# EasyEDA Pro project ProPrj_mykeyboard_2026-01-25.epro, board mykeyboard
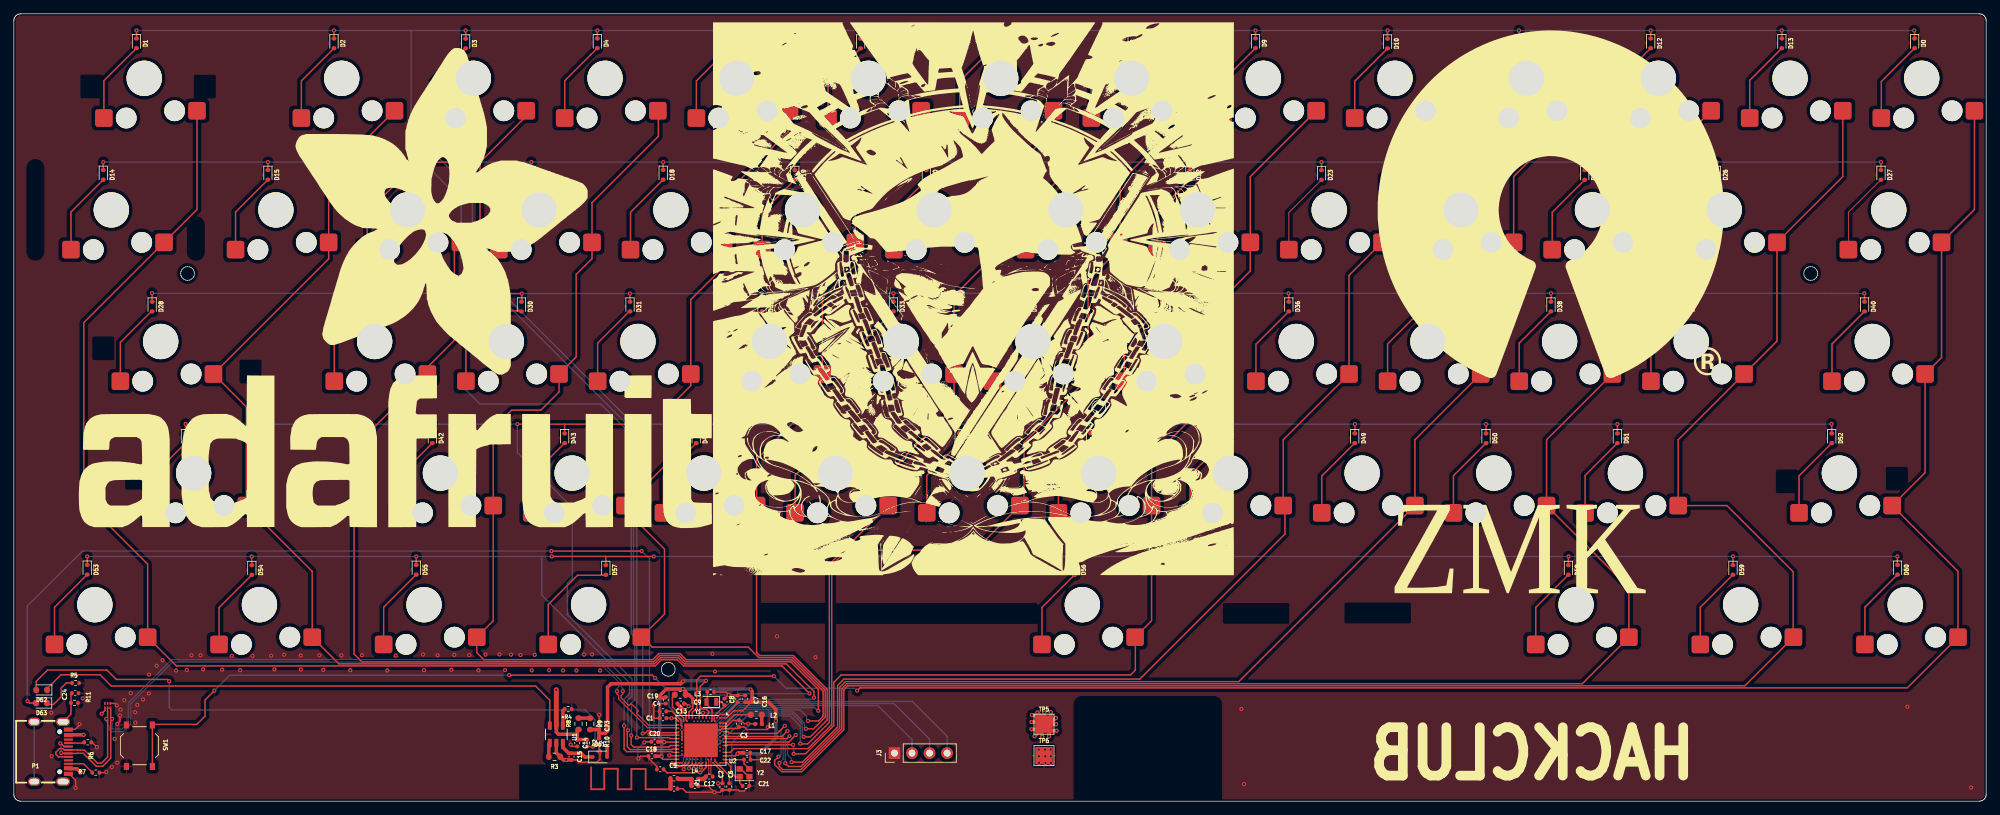
[diagram p1: board, top side]
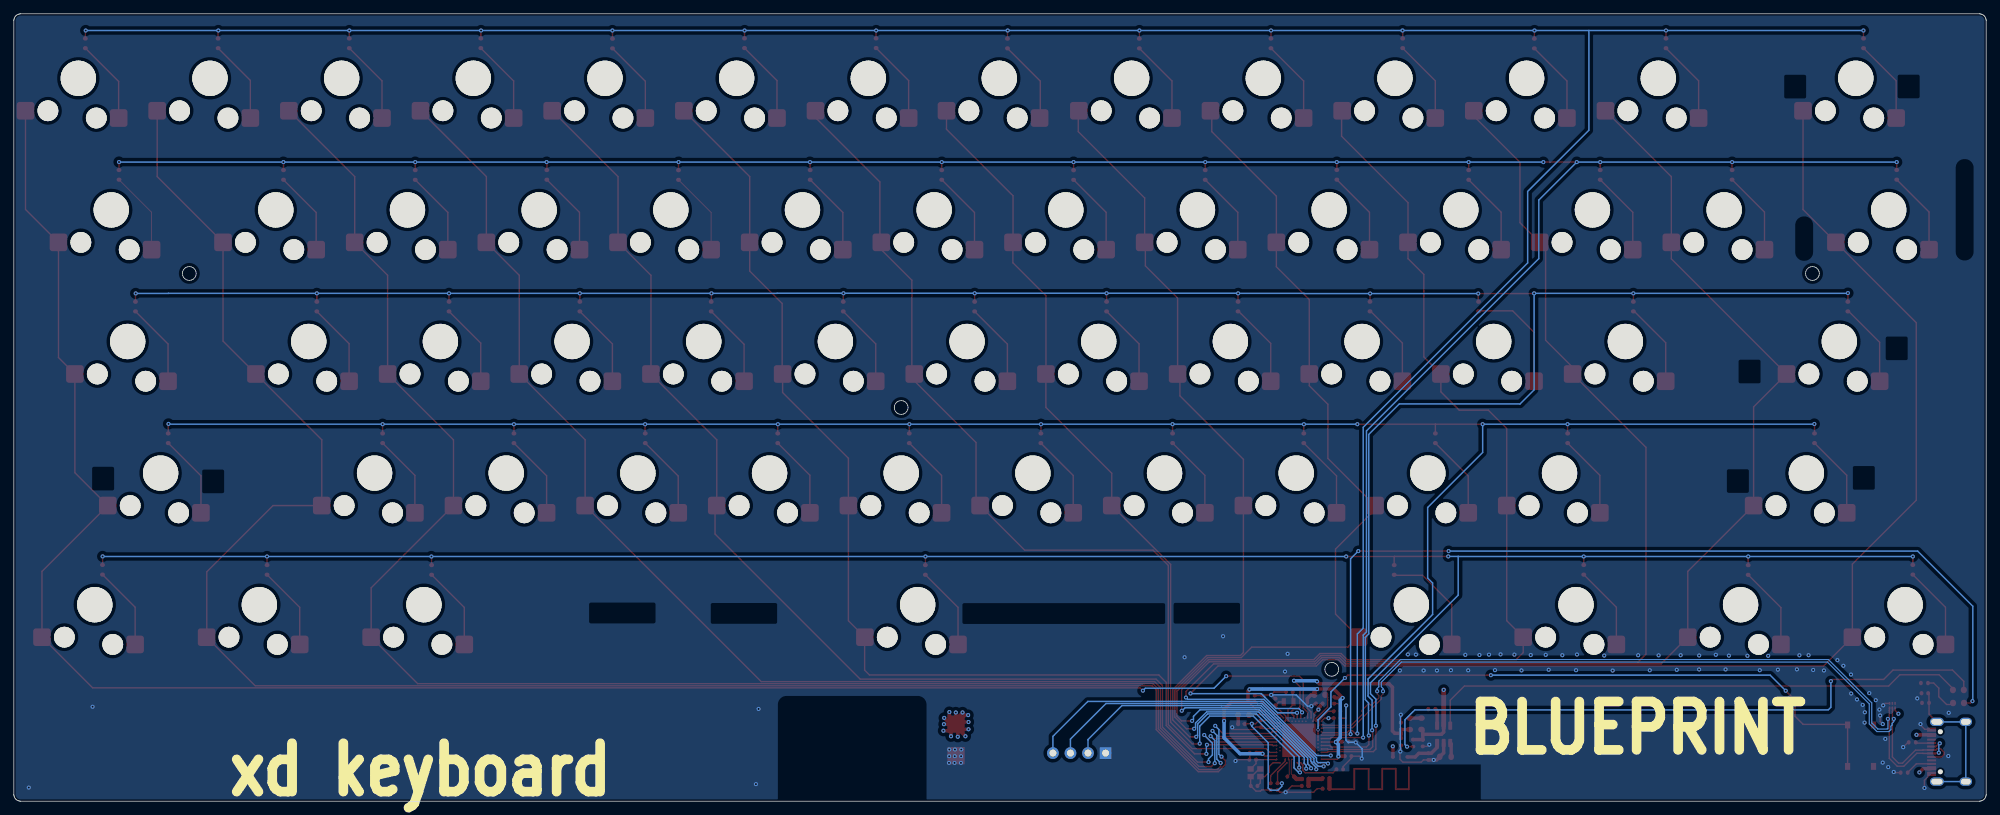
[diagram p2: board, bottom side, seen from below]

Outline 285.38 x 113.98 mm; copper layers: Top Layer, Inner1, Inner2, Bottom Layer. Coordinates in mm from the lower left corner of the outline.
Outline path: 0,112.98 0,1 0,0.92 0.01,0.84 0.03,0.77 0.05,0.69 0.08,0.62 0.11,0.55 0.15,0.48 0.19,0.41 0.24,0.35 0.29,0.29 0.35,0.24 0.41,0.19 0.48,0.15 0.55,0.11 0.62,0.08 0.69,0.05 0.77,0.03 0.84,0.01 0.92,0 1,0 284.37,0 284.45,0 284.53,0.01 284.61,0.03 284.68,0.05 284.76,0.08 284.83,0.11 284.9,0.15 284.96,0.19 285.03,0.24 285.08,0.29 285.14,0.35 285.19,0.41 285.23,0.48 285.27,0.55 285.3,0.62 285.33,0.69 285.35,0.77 285.36,0.84 285.37,0.92 285.38,1 285.38,112.98 285.37,113.05 285.36,113.13 285.35,113.21 285.33,113.28 285.3,113.36 285.27,113.43 285.23,113.5 285.19,113.56 285.14,113.63 285.08,113.68 285.03,113.74 284.96,113.79 284.9,113.83 284.83,113.87 284.76,113.9 284.68,113.93 284.61,113.95 284.53,113.96 284.45,113.97 284.37,113.98 1,113.98 0.92,113.97 0.84,113.96 0.77,113.95 0.69,113.93 0.62,113.9 0.55,113.87 0.48,113.83 0.41,113.79 0.35,113.74 0.29,113.68 0.24,113.63 0.19,113.56 0.15,113.5 0.11,113.43 0.08,113.36 0.05,113.28 0.03,113.21 0.01,113.13 0,113.05 0,112.98 ; 24.14,76.39 24.19,76.7 24.33,76.98 24.55,77.2 24.83,77.34 25.14,77.39 25.45,77.34 25.73,77.2 25.95,76.98 26.09,76.7 26.14,76.39 26.09,76.08 25.95,75.8 25.73,75.58 25.45,75.44 25.14,75.39 24.83,75.44 24.55,75.58 24.33,75.8 24.19,76.08 24.14,76.39 ; 93.69,19.09 93.73,19.4 93.88,19.68 94.1,19.9 94.38,20.04 94.69,20.09 95,20.04 95.28,19.9 95.5,19.68 95.64,19.4 95.69,19.09 95.64,18.78 95.5,18.5 95.28,18.28 95,18.14 94.69,18.09 94.38,18.14 94.1,18.28 93.88,18.5 93.73,18.78 93.69,19.09 ; 155.99,56.99 156.03,57.3 156.18,57.58 156.4,57.8 156.68,57.94 156.99,57.99 157.3,57.94 157.57,57.8 157.8,57.58 157.94,57.3 157.99,56.99 157.94,56.68 157.8,56.4 157.57,56.18 157.3,56.04 156.99,55.99 156.68,56.04 156.4,56.18 156.18,56.4 156.03,56.68 155.99,56.99 ; 258.99,76.39 259.04,76.7 259.18,76.98 259.4,77.2 259.68,77.34 259.99,77.39 260.3,77.34 260.57,77.2 260.8,76.98 260.94,76.7 260.99,76.39 260.94,76.08 260.8,75.8 260.57,75.58 260.3,75.44 259.99,75.39 259.68,75.44 259.4,75.58 259.18,75.8 259.04,76.08 258.99,76.39
Stack: Top Layer 0.035mm Outer layer thickness 1oz / Dielectric1 0.2104mm 7628 RC49% 8.6mil / Inner1 0.0152mm Inner layer thickness / Dielectric2 1.065mm 1.1mm H/HOZ Copper / Inner2 0.0152mm Inner layer thickness / Dielectric3 0.2104mm 7628 RC49% 8.6mil / Bottom Layer 0.035mm Outer layer thickness 1oz

## Design rules (mm)
net USB_D-: DP1
net USB_D+: DP1
template: User Custom Config
spacing safeClearance (default): track to track 0.1, other pairs 0.1 to 0.3
track width trackWidth (default): min 0.127, default 0.254, max 2.54
differential pair differentialPair (default): width min 0.127, default 0.158, max 2.54; gap min 0.203, default 0.203
via viaSize (default): diameter min 0.3, default 0.6, max 10; hole min 0.2, default 0.3, max 6
net GND uses CopperRegion2
pour ie3188 uses CopperRegion2

## Placement (name value [footprint] x y rotation side)
C1  4.7uF  [Capacitor_SMD:C_0402_1005Metric]  93.92 12.01 0 top
C2  1uF  [Capacitor_SMD:C_0402_1005Metric]  102.52 2.11 90 top
C3  47nF  [Capacitor_SMD:C_0402_1005Metric]  104.92 11.21 90 top
C4  4.7uF  [Capacitor_SMD:C_0402_1005Metric]  93.92 13.01 180 top
C5  1nF  [Capacitor_SMD:C_0402_1005Metric]  93.52 4.61 180 top
C6  100pF  [Capacitor_SMD:C_0402_1005Metric]  103.52 2.11 270 top
C7  100nF  [Capacitor_SMD:C_0402_1005Metric]  104.72 14.81 90 top
C8  15pF  [Capacitor_SMD:C_0402_1005Metric]  102.82 14.36 270 top
C9  15pF  [Capacitor_SMD:C_0402_1005Metric]  100.82 15.81 180 top
C10  1.5pF  [Capacitor_SMD:C_0402_1005Metric]  95.52 1.81 180 top
C11  1pF  [Capacitor_SMD:C_0402_1005Metric]  98.52 2.21 180 top
C12  1pF  [Capacitor_SMD:C_0402_1005Metric]  100.62 3.56 180 top
C13  4.7uF  [Capacitor_SMD:C_0402_1005Metric]  96.49 14.13 180 top
C14  1uF  [Capacitor_SMD:C_0402_1005Metric]  81.52 8.41 270 top
C15  1uF  [Capacitor_SMD:C_0402_1005Metric]  80.69 6.45 270 top
C16  100nF  [Capacitor_SMD:C_0402_1005Metric]  105.82 14.81 270 top
C17  100nF  [Capacitor_SMD:C_0402_1005Metric]  106.07 7.01 180 top
C18  100nF  [Capacitor_SMD:C_0402_1005Metric]  92.32 6.51 0 top
C19  4.7uF  [Capacitor_SMD:C_0402_1005Metric]  94.32 14.61 90 top
C20  1uF  [Capacitor_SMD:C_0402_1005Metric]  92.72 8.61 0 top
C21  15pF  [Capacitor_SMD:C_0402_1005Metric]  105.92 2.21 0 top
C22  15pF  [Capacitor_SMD:C_0402_1005Metric]  106.12 6.01 0 top
C23  10nF  [Capacitor_SMD:C_0402_1005Metric]  84.68 10.88 270 top
C24  1000pF/NC  [Capacitor_SMD:C_0402_1005Metric]  8.87 15.63 0 top
D0  D  [Diode_SMD:D_SOD-523]  275.02 109.7 270 top
D1  D  [Diode_SMD:D_SOD-523]  17.74 109.7 270 top
D2  D  [Diode_SMD:D_SOD-523]  46.33 109.7 270 top
D3  D  [Diode_SMD:D_SOD-523]  65.38 109.67 270 top
D4  D  [Diode_SMD:D_SOD-523]  84.42 109.7 270 top
D5  D  [Diode_SMD:D_SOD-523]  103.48 109.69 270 top
D6  D  [Diode_SMD:D_SOD-523]  122.53 109.68 270 top
D7  D  [Diode_SMD:D_SOD-523]  141.6 109.68 270 top
D8  D  [Diode_SMD:D_SOD-523]  160.61 109.72 270 top
D9  D  [Diode_SMD:D_SOD-523]  179.66 109.72 270 top
D10  D  [Diode_SMD:D_SOD-523]  198.75 109.67 270 top
D11  D  [Diode_SMD:D_SOD-523]  217.81 109.71 270 top
D12  D  [Diode_SMD:D_SOD-523]  236.84 109.7 270 top
D13  D  [Diode_SMD:D_SOD-523]  255.81 109.7 270 top
D14  D  [Diode_SMD:D_SOD-523]  12.94 90.67 270 top
D15  D  [Diode_SMD:D_SOD-523]  36.77 90.67 270 top
D16  D  [Diode_SMD:D_SOD-523]  55.85 90.66 270 top
D17  D  [Diode_SMD:D_SOD-523]  74.88 90.65 270 top
D18  D  [Diode_SMD:D_SOD-523]  93.95 90.67 270 top
D19  D  [Diode_SMD:D_SOD-523]  112.99 90.65 270 top
D20  D  [Diode_SMD:D_SOD-523]  132.03 90.64 270 top
D21  D  [Diode_SMD:D_SOD-523]  151.11 90.65 270 top
D22  D  [Diode_SMD:D_SOD-523]  170.16 90.66 270 top
D23  D  [Diode_SMD:D_SOD-523]  189.2 90.64 270 top
D24  D  [Diode_SMD:D_SOD-523]  208.25 90.66 270 top
D25  D  [Diode_SMD:D_SOD-523]  227.29 90.65 270 top
D26  D  [Diode_SMD:D_SOD-523]  246.35 90.65 270 top
D27  D  [Diode_SMD:D_SOD-523]  270.16 90.66 270 top
D28  D  [Diode_SMD:D_SOD-523]  20.02 71.6 270 top
D29  D  [Diode_SMD:D_SOD-523]  51.05 71.6 270 top
D30  D  [Diode_SMD:D_SOD-523]  73.44 71.6 270 top
D31  D  [Diode_SMD:D_SOD-523]  89.16 71.6 270 top
D32  D  [Diode_SMD:D_SOD-523]  108.24 71.6 270 top
D33  D  [Diode_SMD:D_SOD-523]  127.26 71.6 270 top
D34  D  [Diode_SMD:D_SOD-523]  146.35 71.6 270 top
D35  D  [Diode_SMD:D_SOD-523]  165.36 71.6 270 top
D36  D  [Diode_SMD:D_SOD-523]  184.47 71.6 270 top
D37  D  [Diode_SMD:D_SOD-523]  203.47 71.6 270 top
D38  D  [Diode_SMD:D_SOD-523]  222.4 71.6 270 top
D39  D  [Diode_SMD:D_SOD-523]  241.53 71.6 270 top
D40  D  [Diode_SMD:D_SOD-523]  267.77 71.6 270 top
D41  D  [Diode_SMD:D_SOD-523]  24.84 52.53 270 top
D42  D  [Diode_SMD:D_SOD-523]  60.55 52.53 270 top
D43  D  [Diode_SMD:D_SOD-523]  79.69 52.53 270 top
D44  D  [Diode_SMD:D_SOD-523]  98.73 52.53 270 top
D45  D  [Diode_SMD:D_SOD-523]  117.72 52.53 270 top
D46  D  [Diode_SMD:D_SOD-523]  136.77 52.53 270 top
D47  D  [Diode_SMD:D_SOD-523]  155.81 52.53 270 top
D48  D  [Diode_SMD:D_SOD-523]  174.84 52.53 270 top
D49  D  [Diode_SMD:D_SOD-523]  194.01 52.53 270 top
D50  D  [Diode_SMD:D_SOD-523]  213.01 52.53 270 top
D51  D  [Diode_SMD:D_SOD-523]  232.01 52.53 270 top
D52  D  [Diode_SMD:D_SOD-523]  263.03 52.53 270 top
D53  D  [Diode_SMD:D_SOD-523]  10.62 33.5 270 top
D54  D  [Diode_SMD:D_SOD-523]  34.44 33.46 270 top
D55  D  [Diode_SMD:D_SOD-523]  58.23 33.49 270 top
D56  D  [Diode_SMD:D_SOD-523]  153.48 33.47 270 top
D57  D  [Diode_SMD:D_SOD-523]  85.66 33.47 270 top
D58  D  [Diode_SMD:D_SOD-523]  224.92 33.47 270 top
D59  D  [Diode_SMD:D_SOD-523]  248.73 33.48 270 top
D60  D  [Diode_SMD:D_SOD-523]  272.55 33.5 270 top
D61  B5819W SL  [Diode_SMD:D_SOD-323]  84.78 6.4 0 top
D62  CHG  [LED_SMD:LED_0603_1608Metric]  4.03 16.1 180 top
D63  BLUE  [LED_SMD:LED_0603_1608Metric]  4 14.21 180 top
J3  Debug  [Connector_PinHeader_2.54mm:PinHeader_1x04_P2.54mm_Vertical]  127.41 6.96 90 top
K0  ~~,`  [Gateron_KS33_Hotswap:Gateron-KS33-Hotswap-1U]  276.04 104.64 0 top
K1  !,1  [Gateron_KS33_Hotswap:Gateron-KS33-Hotswap-1U]  256.99 104.64 0 top
K2  @,2  [Gateron_KS33_Hotswap:Gateron-KS33-Hotswap-1U]  47.44 104.64 0 top
K3  #,3  [Gateron_KS33_Hotswap:Gateron-KS33-Hotswap-1U]  66.49 104.64 0 top
K4  $,4  [Gateron_KS33_Hotswap:Gateron-KS33-Hotswap-1U]  85.54 104.64 0 top
K5  %,5  [Gateron_KS33_Hotswap:Gateron-KS33-Hotswap-1U]  104.59 104.64 0 top
K6  ^,6  [Gateron_KS33_Hotswap:Gateron-KS33-Hotswap-1U]  123.64 104.64 0 top
K7  &,7  [Gateron_KS33_Hotswap:Gateron-KS33-Hotswap-1U]  142.79 104.64 0 top
K8  *,8  [Gateron_KS33_Hotswap:Gateron-KS33-Hotswap-1U]  161.74 104.64 0 top
K9  (,9  [Gateron_KS33_Hotswap:Gateron-KS33-Hotswap-1U]  180.79 104.64 0 top
K10  ),0  [Gateron_KS33_Hotswap:Gateron-KS33-Hotswap-1U]  199.84 104.64 0 top
K11  _,-  [Gateron_KS33_Hotswap:Gateron-KS33-Hotswap-1U]  218.89 104.64 0 top
K12  +,=  [Gateron_KS33_Hotswap:Gateron-KS33-Hotswap-1U]  237.94 104.64 0 top
K13  Backspace  [Gateron_KS33_Hotswap:Gateron-KS33-Hotswap-2U]  18.87 104.64 0 top
K14  Tab  [Gateron_KS33_Hotswap:Gateron-KS33-Hotswap-1.5U]  14.1 85.59 0 top
K15  Q  [Gateron_KS33_Hotswap:Gateron-KS33-Hotswap-1U]  37.92 85.59 0 top
K16  W  [Gateron_KS33_Hotswap:Gateron-KS33-Hotswap-1U]  56.97 85.59 0 top
K17  E  [Gateron_KS33_Hotswap:Gateron-KS33-Hotswap-1U]  76.02 85.59 0 top
K18  R  [Gateron_KS33_Hotswap:Gateron-KS33-Hotswap-1U]  95.07 85.59 0 top
K19  T  [Gateron_KS33_Hotswap:Gateron-KS33-Hotswap-1U]  114.12 85.59 0 top
K20  Y  [Gateron_KS33_Hotswap:Gateron-KS33-Hotswap-1U]  133.17 85.59 0 top
K21  U  [Gateron_KS33_Hotswap:Gateron-KS33-Hotswap-1U]  152.22 85.59 0 top
K22  I  [Gateron_KS33_Hotswap:Gateron-KS33-Hotswap-1U]  171.27 85.59 0 top
K23  O  [Gateron_KS33_Hotswap:Gateron-KS33-Hotswap-1U]  190.32 85.59 0 top
K24  P  [Gateron_KS33_Hotswap:Gateron-KS33-Hotswap-1U]  209.37 85.59 0 top
K25  {,[  [Gateron_KS33_Hotswap:Gateron-KS33-Hotswap-1U]  228.42 85.59 0 top
K26  },]  [Gateron_KS33_Hotswap:Gateron-KS33-Hotswap-1U]  247.47 85.59 0 top
K27  |,\\  [Gateron_KS33_Hotswap:Gateron-KS33-Hotswap-1.5U]  271.28 85.59 0 top
K28  Caps Lock  [Gateron_KS33_Hotswap:Gateron-KS33-Hotswap-1.75U]  268.9 66.54 0 top
K29  A  [Gateron_KS33_Hotswap:Gateron-KS33-Hotswap-1U]  52.2 66.54 0 top
K30  S  [Gateron_KS33_Hotswap:Gateron-KS33-Hotswap-1U]  71.25 66.54 0 top
K31  D  [Gateron_KS33_Hotswap:Gateron-KS33-Hotswap-1U]  90.3 66.54 0 top
K32  F  [Gateron_KS33_Hotswap:Gateron-KS33-Hotswap-1U]  109.35 66.54 0 top
K33  G  [Gateron_KS33_Hotswap:Gateron-KS33-Hotswap-1U]  128.4 66.54 0 top
K34  H  [Gateron_KS33_Hotswap:Gateron-KS33-Hotswap-1U]  147.45 66.54 0 top
K35  J  [Gateron_KS33_Hotswap:Gateron-KS33-Hotswap-1U]  166.5 66.54 0 top
K36  K  [Gateron_KS33_Hotswap:Gateron-KS33-Hotswap-1U]  185.55 66.54 0 top
K37  L  [Gateron_KS33_Hotswap:Gateron-KS33-Hotswap-1U]  204.6 66.54 0 top
K38  :,;  [Gateron_KS33_Hotswap:Gateron-KS33-Hotswap-1U]  223.65 66.54 0 top
K39  \",'  [Gateron_KS33_Hotswap:Gateron-KS33-Hotswap-1U]  242.7 66.54 0 top
K40  Enter  [Gateron_KS33_Hotswap:Gateron-KS33-Hotswap-2.25U]  21.25 66.54 0 top
K41  Shift  [Gateron_KS33_Hotswap:Gateron-KS33-Hotswap-2.25U]  264.14 47.49 0 top
K42  Z  [Gateron_KS33_Hotswap:Gateron-KS33-Hotswap-1U]  61.73 47.49 0 top
K43  X  [Gateron_KS33_Hotswap:Gateron-KS33-Hotswap-1U]  80.78 47.49 0 top
K44  C  [Gateron_KS33_Hotswap:Gateron-KS33-Hotswap-1U]  99.83 47.49 0 top
K45  V  [Gateron_KS33_Hotswap:Gateron-KS33-Hotswap-1U]  118.88 47.49 0 top
K46  B  [Gateron_KS33_Hotswap:Gateron-KS33-Hotswap-1U]  137.93 47.49 0 top
K47  N  [Gateron_KS33_Hotswap:Gateron-KS33-Hotswap-1U]  156.98 47.49 0 top
K48  M  [Gateron_KS33_Hotswap:Gateron-KS33-Hotswap-1U]  176.03 47.49 0 top
K49  <,,  [Gateron_KS33_Hotswap:Gateron-KS33-Hotswap-1U]  195.08 47.49 0 top
K50  >,.  [Gateron_KS33_Hotswap:Gateron-KS33-Hotswap-1U]  214.13 47.49 0 top
K51  ?,/  [Gateron_KS33_Hotswap:Gateron-KS33-Hotswap-1U]  233.18 47.49 0 top
K52  Shift  [Gateron_KS33_Hotswap:Gateron-KS33-Hotswap-2.75U]  26.01 47.49 0 top
K53  Ctrl  [Gateron_KS33_Hotswap:Gateron-KS33-Hotswap-1.25U]  11.72 28.44 0 top
K54  Win  [Gateron_KS33_Hotswap:Gateron-KS33-Hotswap-1.25U]  35.54 28.44 0 top
K55  Alt  [Gateron_KS33_Hotswap:Gateron-KS33-Hotswap-1.25U]  59.35 28.44 0 top
K56  Blank  [Gateron_KS33_Hotswap:Gateron-KS33-Hotswap-6.25U]  154.6 28.44 0 top
K57  Alt  [Gateron_KS33_Hotswap:Gateron-KS33-Hotswap-1.25U]  83.16 28.44 0 top
K58  Win  [Gateron_KS33_Hotswap:Gateron-KS33-Hotswap-1.25U]  226.04 28.44 0 top
K59  Menu  [Gateron_KS33_Hotswap:Gateron-KS33-Hotswap-1.25U]  249.85 28.44 0 top
K60  Ctrl  [Gateron_KS33_Hotswap:Gateron-KS33-Hotswap-1.25U]  273.66 28.44 0 top
L1  15nH  [Inductor_SMD:L_0402_1005Metric]  107.75 11.17 0 top
L2  10uH  [Inductor_SMD:L_0603_1608Metric]  107.42 12.51 180 top
L3  10uH  [Inductor_SMD:L_0603_1608Metric]  96.42 15.41 180 top
L4  3.9nH  [Inductor_SMD:L_0402_1005Metric]  98.52 3.21 0 top
NOREF  -  [Pad_e4740]  25.12 76.39 0 top
NOREF#2  -  [Pad_e4739]  156.98 56.98 0 top
NOREF#3  -  [Pad_e4736]  259.98 76.4 0 top
NOREF#4  -  [Pad_e4738]  94.69 19.09 0 top
P1  USB-C  [USB-C_SMD-TYPE-C-31-M-12_1]  5.42 7.16 270 top
R1  0R  [Resistor_SMD:R_0402_1005Metric]  95.52 3.31 180 top
R2  10k  [Resistor_SMD:R_0402_1005Metric]  82.91 8.41 270 top
R3  2.7k  [Resistor_SMD:R_0603_1608Metric]  78.23 6.43 180 top
R4  10k  [Resistor_SMD:R_0402_1005Metric]  80.2 13.33 180 top
R5  1.5k  [Resistor_SMD:R_0402_1005Metric]  8.93 17.1 180 top
R6  5.1k  [Resistor_SMD:R_0402_1005Metric]  10.69 8.52 0 top
R7  5.1k  [Resistor_SMD:R_0402_1005Metric]  11.87 4.13 0 top
R8  2M  [Resistor_SMD:R_0603_1608Metric]  81.7 11.2 90 top
R9  2M  [Resistor_SMD:R_0603_1608Metric]  83.39 11.19 270 top
R10  10M  [Resistor_SMD:R_0402_1005Metric]  84.66 8.59 270 top
R11  1M  [Resistor_SMD:R_0402_1005Metric]  8.78 14.23 180 top
SW1  Reset  [Button_Switch_SMD:SW_Push_1P1T_XKB_TS-1187A]  18.17 8.03 270 top
TP5  VBAT  [TestPoint:TestPoint_Pad_2.5x2.5mm]  149.05 11.15 0 top
TP6  BAT GND  [TestPoint:TestPoint_Pad_2.5x2.5mm]  149.05 6.6 0 top
U1  BQ21040DBVR  [BQ21040:SOT95P280X145-6N]  78.49 9.68 270 top
U2  nRF52840  [Package_DFN_QFN:Nordic_AQFN-73-1EP_7x7mm_P0.5mm]  99.42 8.81 270 top
U3  ESDR0502NMUTAG  [mikoto-footprints:UDFN-6_1.2x1.0mm_P0.4mm]  13.58 13.83 270 top
Y1  32.768 kHz  [Crystal:Crystal_SMD_2012-2Pin_2.0x1.2mm]  100.92 14.36 180 top
Y2  32MHz  [Crystal:Crystal_SMD_2016-4Pin_2.0x1.6mm]  105.72 4.11 0 top

## Footprints (pads in the part's own frame, mm; a bottom-side part is the same pattern mirrored in y, then rotated)
BQ21040:SOT95P280X145-6N
  rrect 1.21x0.58 smd: 1(-1.255,0.95) 2(-1.255,0) 3(-1.255,-0.95) 4(1.255,-0.95) 5(1.255,0) 6(1.255,0.95)
Button_Switch_SMD:SW_Push_1P1T_XKB_TS-1187A
  rect 1x0.75 smd: 1(-3,1.875) 1(3,1.875) 2(-3,-1.875) 2(3,-1.875)
Capacitor_SMD:C_0402_1005Metric
  rrect 0.56x0.62 smd: 1(-0.48,0) 2(0.48,0)
Connector_PinHeader_2.54mm:PinHeader_1x04_P2.54mm_Vertical
  rect 1.7x1.7 hole 1: 1(0,0)
  round 1.7 hole 1: 2(0,-2.54) 3(0,-5.08) 4(0,-7.62)
Crystal:Crystal_SMD_2012-2Pin_2.0x1.2mm
  rect 0.6x1.1 smd: 1(-0.7,0) 2(0.7,0)
Crystal:Crystal_SMD_2016-4Pin_2.0x1.6mm
  rect 0.9x0.8 smd: 1(-0.7,-0.55) 2(0.7,-0.55) 3(0.7,0.55) 4(-0.7,0.55)
Diode_SMD:D_SOD-323
  rrect 0.6x0.45 smd: 1(-1.05,0) 2(1.05,0)
Diode_SMD:D_SOD-523
  rrect 0.6x0.7 smd: 1(-0.7,0) 2(0.7,0)
Gateron_KS33_Hotswap:Gateron-KS33-Hotswap-1.5U
  round 3 hole 3: (-2.6,-5.75) (4.4,-4.7)
  round 5.1 hole 5.1: (0,0)
  rrect 2.55x2.55 smd: 1(7.638,-4.7) 2(-5.838,-5.75)
Gateron_KS33_Hotswap:Gateron-KS33-Hotswap-1.25U
  round 3 hole 3: (-2.6,-5.75) (4.4,-4.7)
  round 5.1 hole 5.1: (0,0)
  rrect 2.55x2.55 smd: 1(7.638,-4.7) 2(-5.838,-5.75)
Gateron_KS33_Hotswap:Gateron-KS33-Hotswap-1.75U
  round 3 hole 3: (-2.6,-5.75) (4.4,-4.7)
  round 5.1 hole 5.1: (0,0)
  rrect 2.55x2.55 smd: 1(7.638,-4.7) 2(-5.838,-5.75)
Gateron_KS33_Hotswap:Gateron-KS33-Hotswap-1U
  round 3 hole 3: (-2.6,-5.75) (4.4,-4.7)
  round 5.1 hole 5.1: (0,0)
  rrect 2.55x2.55 smd: 1(7.638,-4.7) 2(-5.838,-5.75)
Gateron_KS33_Hotswap:Gateron-KS33-Hotswap-2.25U
  round 3 hole 3: (-2.6,-5.75) (4.4,-4.7)
  round 5.1 hole 5.1: (0,0)
  rrect 2.55x2.55 smd: 1(7.638,-4.7) 2(-5.838,-5.75)
Gateron_KS33_Hotswap:Gateron-KS33-Hotswap-2.75U
  round 3 hole 3: (-2.6,-5.75) (4.4,-4.7)
  round 5.1 hole 5.1: (0,0)
  rrect 2.55x2.55 smd: 1(7.638,-4.7) 2(-5.838,-5.75)
Gateron_KS33_Hotswap:Gateron-KS33-Hotswap-2U
  round 3 hole 3: (-2.6,-5.75) (4.4,-4.7)
  round 5.1 hole 5.1: (0,0)
  rrect 2.55x2.55 smd: 1(7.638,-4.7) 2(-5.838,-5.75)
Gateron_KS33_Hotswap:Gateron-KS33-Hotswap-6.25U
  round 3 hole 3: (-2.6,-5.75) (4.4,-4.7)
  round 5.1 hole 5.1: (0,0)
  rrect 2.55x2.55 smd: 1(7.638,-4.7) 2(-5.838,-5.75)
Inductor_SMD:L_0402_1005Metric
  rrect 0.59x0.64 smd: 1(-0.485,0) 2(0.485,0)
Inductor_SMD:L_0603_1608Metric
  rrect 0.875x0.95 smd: 1(-0.787,0) 2(0.787,0)
LED_SMD:LED_0603_1608Metric
  rrect 0.875x0.95 smd: 1(-0.787,0) 2(0.787,0)
mikoto-footprints:UDFN-6_1.2x1.0mm_P0.4mm
  rect 0.42x0.22 smd: 1(-0.325,0.4) 2(-0.325,0) 3(-0.325,-0.4) 4(0.325,-0.4) 5(0.325,0) 6(0.325,0.4)
Package_DFN_QFN:Nordic_AQFN-73-1EP_7x7mm_P0.5mm
  rect 2x2 smd: (-1.212,1.212) (-1.212,-1.212) (1.212,1.212) (1.212,-1.212)
  round 0.25 smd: A8(-1.25,3.25) A10(-0.75,3.25) A12(-0.25,3.25) A14(0.25,3.25) A16(0.75,3.25) A18(1.25,3.25) A20(1.75,3.25) A22(2.25,3.25) A23(2.75,3.25) AA24(3.25,-2.25) AB2(-2.75,-2.5) AC5(-2,-2.75) AC9(-1,-2.75) AC11(-0.5,-2.75) AC13(0,-2.75) AC15(0.5,-2.75) AC17(1,-2.75) AC19(1.5,-2.75) AC21(2,-2.75) AC24(3.25,-2.75) AD2(-2.75,-3.25) AD4(-2.25,-3.25) AD6(-1.75,-3.25) AD8(-1.25,-3.25) AD10(-0.75,-3.25) AD12(-0.25,-3.25) AD14(0.25,-3.25) AD16(0.75,-3.25) AD18(1.25,-3.25) AD20(1.75,-3.25) AD22(2.25,-3.25) AD23(2.75,-3.25) B1(-3.25,2.75) B3(-2.5,2.75) B5(-2,2.75) B7(-1.5,2.75) B9(-1,2.75) B11(-0.5,2.75) B13(0,2.75) B15(0.5,2.75) B17(1,2.75) B19(1.5,2.75) B24(3.25,2.75) C1(-3.25,2.25) D2(-2.75,2) D23(2.75,2) E24(3.25,1.75) F2(-2.75,1.5) F23(2.75,1.5) G1(-3.25,1.25) H2(-2.75,1) H23(2.75,1) J1(-3.25,0.75) J24(3.25,0.75) K2(-2.75,0.5) L1(-3.25,0.25) L24(3.25,0.25) M2(-2.75,0) N1(-3.25,-0.25) N24(3.25,-0.25) P2(-2.75,-0.5) P23(2.75,-0.5) R1(-3.25,-0.75) R24(3.25,-0.75) T2(-2.75,-1) T23(2.75,-1) U1(-3.25,-1.25) U24(3.25,-1.25) V23(2.75,-1.5) W1(-3.25,-1.75) W24(3.25,-1.75) Y2(-2.75,-2) Y23(2.75,-2)
  rect 4.85x4.85 smd: EP(0,0)
Pad_e4736
  round 0.003 hole 2: 1(0,0)
Pad_e4738
  round 0.003 hole 2: 1(0,0)
Pad_e4739
  round 0.003 hole 2: 1(0,0)
Pad_e4740
  round 0.003 hole 2: 1(0,0)
Resistor_SMD:R_0402_1005Metric
  rrect 0.54x0.64 smd: 1(-0.51,0) 2(0.51,0)
Resistor_SMD:R_0603_1608Metric
  rrect 0.8x0.95 smd: 1(-0.825,0) 2(0.825,0)
TestPoint:TestPoint_Pad_2.5x2.5mm
  rect 2.5x2.5 smd: 1(0,0)
USB-C_SMD-TYPE-C-31-M-12_1
  oval 1.2x2 hole 0.8x1.6: 1(4.325,1.706) 4(-4.325,1.706)
  oval 1.2x1.8 hole 0.8x1.4: 2(4.325,-2.474) 3(-4.325,-2.474)
  custom 0.6x1.3 smd: A1B12(-3.2,2.474) A4B9(-2.4,2.474) B1A12(3.2,2.474) B4A9(2.401,2.474)
  rect 0.3x1.3 smd: A5(-1.25,2.474) A6(-0.25,2.474) A7(0.25,2.474) A8(1.25,2.474) B5(1.75,2.474) B6(0.75,2.474) B7(-0.75,2.474) B8(-1.75,2.474)

## Nets
GND: C1.1 C2.1 C3.1 C4.2 C5.2 C6.2 C7.2 C8.1 C9.1 C10.1 C11.1 C13.1 C14.2 C15.2 C16.1 C17.1 C18.1 C19.1 C20.1 C21.2 C22.2 C23.1 C24.2 J3.1 R3.1 R4.1 R5.1 R6.2 R7.2 R10.2 R11.1 SW1.2 TP6.1 U1.5 U2.B7 U2.EP U3.1 Y2.2 Y2.4
VBAT: C13.2 C14.1 R2.1 R8.1 TP5.1 U1.2 U2.Y2
VBUS: C1.2 D61.2 P1.A4B9 P1.B4A9 U2.AD2 U3.4
VDD_NRF: C16.2 C17.2 C18.2 C19.2 C20.2 L3.1 U2.A22 U2.AD14 U2.AD23 U2.B1 U2.W1
VSS_PA: C12.1 U2.F23
/ANT: C10.2 R1.2
/CC1: P1.A5 R6.1
/CC2: P1.B5 R7.1
/COL_0: K0.1 K27.1 K28.1 K41.1 K60.1 U2.U1
/COL_1: K1.1 K26.1 K39.1 K51.1 K59.1 U2.A8
/COL_2: K12.1 K25.1 K38.1 K50.1 K58.1 U2.A10
/COL_3: K11.1 K24.1 K37.1 K49.1 U2.A12
/COL_4: K10.1 K23.1 K36.1 K48.1 U2.A14
/COL_5: K9.1 K22.1 K35.1 K47.1 K56.1 U2.A16
/COL_6: K8.1 K21.1 K34.1 K46.1 U2.A20
/COL_7: K7.1 K20.1 K33.1 K45.1 U2.J24
/COL_8: K6.1 K19.1 K32.1 K44.1 U2.L24
/COL_9: K5.1 K18.1 K31.1 K43.1 K57.1 U2.R24
/COL_10: K4.1 K17.1 K30.1 K42.1 K55.1 U2.U24
/COL_11: K3.1 K16.1 K29.1 U2.W24
/COL_12: K2.1 K15.1 K40.1 K52.1 K54.1 U2.L1
/COL_13: K13.1 K14.1 K53.1 U2.N1
/ROW_0: D0.1 D1.1 D2.1 D3.1 D4.1 D5.1 D6.1 D7.1 D8.1 D9.1 D10.1 D11.1 D12.1 D13.1 U2.AD8
/ROW_1: D14.1 D15.1 D16.1 D17.1 D18.1 D19.1 D20.1 D21.1 D22.1 D23.1 D24.1 D25.1 D26.1 D27.1 U2.AD12
/ROW_2: D28.1 D29.1 D30.1 D31.1 D32.1 D33.1 D34.1 D35.1 D36.1 D37.1 D38.1 D39.1 D40.1 U2.AD16
/ROW_3: D41.1 D42.1 D43.1 D44.1 D45.1 D46.1 D47.1 D48.1 D49.1 D50.1 D51.1 D52.1 U2.AD18
/ROW_4: D53.1 D54.1 D55.1 D56.1 D57.1 D58.1 D59.1 D60.1 U2.AD20
BAT_VOLT: C23.2 R9.2 R10.1 U2.J1
BLUE_LED: D63.2 U2.AD10
NET-(C11-PAD2): C11.2 L4.1 R1.1
NET-(D0-A): D0.2 K0.2
NET-(D1-A): D13.2 K1.2
NET-(D2-A): D2.2 K2.2
NET-(D3-A): D3.2 K3.2
NET-(D4-A): D4.2 K4.2
NET-(D5-A): D5.2 K5.2
NET-(D6-A): D6.2 K6.2
NET-(D7-A): D7.2 K7.2
NET-(D8-A): D8.2 K8.2
NET-(D9-A): D9.2 K9.2
NET-(D10-A): D10.2 K10.2
NET-(D11-A): D11.2 K11.2
NET-(D12-A): D12.2 K12.2
NET-(D13-A): D1.2 K13.2
NET-(D14-A): D14.2 K14.2
NET-(D15-A): D15.2 K15.2
NET-(D16-A): D16.2 K16.2
NET-(D17-A): D17.2 K17.2
NET-(D18-A): D18.2 K18.2
NET-(D19-A): D19.2 K19.2
NET-(D20-A): D20.2 K20.2
NET-(D21-A): D21.2 K21.2
NET-(D22-A): D22.2 K22.2
NET-(D23-A): D23.2 K23.2
NET-(D24-A): D24.2 K24.2
NET-(D25-A): D25.2 K25.2
NET-(D26-A): D26.2 K26.2
NET-(D27-A): D27.2 K27.2
NET-(D28-A): D40.2 K28.2
NET-(D29-A): D29.2 K29.2
NET-(D30-A): D30.2 K30.2
NET-(D31-A): D31.2 K31.2
NET-(D32-A): D32.2 K32.2
NET-(D33-A): D33.2 K33.2
NET-(D34-A): D34.2 K34.2
NET-(D35-A): D35.2 K35.2
NET-(D36-A): D36.2 K36.2
NET-(D37-A): D37.2 K37.2
NET-(D38-A): D38.2 K38.2
NET-(D39-A): D39.2 K39.2
NET-(D40-A): D28.2 K40.2
NET-(D41-A): D52.2 K41.2
NET-(D42-A): D42.2 K42.2
NET-(D43-A): D43.2 K43.2
NET-(D44-A): D44.2 K44.2
NET-(D45-A): D45.2 K45.2
NET-(D46-A): D46.2 K46.2
NET-(D47-A): D47.2 K47.2
NET-(D48-A): D48.2 K48.2
NET-(D49-A): D49.2 K49.2
NET-(D50-A): D50.2 K50.2
NET-(D51-A): D51.2 K51.2
NET-(D52-A): D41.2 K52.2
NET-(D53-A): D53.2 K53.2
NET-(D54-A): D54.2 K54.2
NET-(D55-A): D55.2 K55.2
NET-(D56-A): D56.2 K56.2
NET-(D57-A): D57.2 K57.2
NET-(D58-A): D58.2 K58.2
NET-(D59-A): D59.2 K59.2
NET-(D60-A): D60.2 K60.2
NET-(D61-K): C15.1 D61.1 U1.6
NET-(D62-A): D62.2 R2.2
NET-(D62-K): D62.1 U1.3
NET-(D63-K): D63.1 R5.2
NET-(L1-PAD2): L1.2 L2.1
NET-(P1-SHIELD): C24.1 P1.1 P1.2 P1.3 P1.4 R11.2
NET-(R8-PAD2): R8.2 R9.1
NET-(U1-ISET): R3.2 U1.4
NET-(U1-TS): R4.2 U1.1
NET-(U2-ANT): C12.2 L4.2 U2.H23
NET-(U2-DCC): L2.2 U2.B3
NET-(U2-DCCH): L3.2 U2.AB2
NET-(U2-DEC1): C7.1 U2.C1
NET-(U2-DEC3): C6.1 U2.D23
NET-(U2-DEC4): C2.2 C3.2 L1.1 U2.B5 U2.E24
NET-(U2-DEC5): C5.1 U2.N24
NET-(U2-DECUSB): C4.1 U2.AC5
NET-(U2-XC1): C21.1 U2.B24 Y2.1
NET-(U2-XC2): C22.1 U2.A23 Y2.3
NET-(U2-XL1{SLASH}P0.00): C8.2 U2.D2 Y1.1
NET-(U2-XL2{SLASH}P0.01): C9.2 U2.F2 Y1.2
RESET: SW1.1 U2.AC9 U2.AC11 U2.AC13
SWC: J3.2 U2.AA24
SWD: J3.3 U2.AC24
SWO: J3.4 U2.AD22
UNCONNECTED-(U2-AIN1{SLASH}P0.03-PADB13): U2.B13
UNCONNECTED-(U2-AIN3{SLASH}P0.05-PADK2): U2.K2
UNCONNECTED-(U2-AIN4{SLASH}P0.28-PADB11): U2.B11
UNCONNECTED-(U2-AIN6{SLASH}P0.30-PADB9): U2.B9
UNCONNECTED-(U2-DEC2-PADA18): U2.A18
UNCONNECTED-(U2-P0.19-PADAC15): U2.AC15
UNCONNECTED-(U2-P0.21-PADAC17): U2.AC17
UNCONNECTED-(U2-P0.23-PADAC19): U2.AC19
UNCONNECTED-(U2-P0.26-PADG1): U2.G1
UNCONNECTED-(U2-P0.27-PADH2): U2.H2
UNCONNECTED-(U2-P1.01-PADY23): U2.Y23
UNCONNECTED-(U2-P1.03-PADV23): U2.V23
UNCONNECTED-(U2-P1.05-PADT23): U2.T23
UNCONNECTED-(U2-P1.07-PADP23): U2.P23
UNCONNECTED-(U2-P1.08-PADP2): U2.P2
UNCONNECTED-(U2-P1.11-PADB19): U2.B19
UNCONNECTED-(U2-P1.12-PADB17): U2.B17
UNCONNECTED-(U2-P1.14-PADB15): U2.B15
UNCONNECTED-(U2-TRACECLK{SLASH}P0.07-PADM2): U2.M2
UNCONNECTED-(U2-TRACEDATA2{SLASH}P0.11-PADT2): U2.T2
UNCONNECTED-(U2-TRACEDATA3{SLASH}P1.09-PADR1): U2.R1
UNCONNECTED-(U3-NC-PAD2): U3.2
UNCONNECTED-(U3-NC-PAD3): U3.3
USB_D+: P1.A6 P1.B6 U2.AD6 U3.5
USB_D-: P1.A7 P1.B7 U2.AD4 U3.6

Pads without a net: NOREF 1; NOREF#2 1; NOREF#3 1; NOREF#4 1; P1 A1B12 A8 B1A12 B8; U2 AC21

## Via types
v1: diameter 0.6, hole 0.3, Top Layer to Bottom Layer, 237 vias
v2: diameter 0.61, hole 0.305, Top Layer to Bottom Layer, 2 vias
v3: diameter 0.45, hole 0.3, Top Layer to Bottom Layer, 1 via

## Routing (per net, layer and track width the routed paths; a pad name or vN(x,y) marks a point on that pad's centre or on a via; arc(x,y) is an arc through that point)
GND: length 91.8
  Top Layer w0.2: C19.1 93.69,14.13 93.44,13.88 C4.2 C1.1 92.67,12.01 92.59,12.09 v1(92.59,13.85) ; v1(13.37,4.23) 13.28,4.13 R7.2 ; C20.1 91.32,8.61 v1(91.22,8.51) ; v1(9.51,11.16) 9.51,11.01 8.9,10.41 8.05,10.41 ; C8.1 103.37,15.38 v2(103.45,15.38) ; v2(12.01,7.82) 11.31,8.52 R6.2 ; 96.98,14.13 97.26,14.13 v1(97.63,13.76) ; v1(8.94,1.91) 8.94,3.03 8.05,3.91 ; U2.EP 99.42,10.23 99.51,10.31 U2.B7 102.25,10.31 102.45,10.51 104.7,10.51 C3.1 105.72,10.73 106.08,10.37 109,10.37 109.08,10.45 v1(109.08,10.7) ; C9.1 103.02,15.81 v2(103.45,15.38) ; C14.2 80.82,7.93 v1(80.57,8.18) ; C15.2 81.38,5.97 81.41,6 81.75,5.65 84.39,5.65 84.81,6.07 84.81,7.42 84.66,7.57 R10.2 ; C11.1 100.44,2.21 v1(101.36,1.29) ; v1(108.61,5.82) 108.42,6.01 C22.2 106.55,6.06 C17.1 ; v1(90.35,6.17) 90.69,6.51 C18.1 91.84,6.2 93.04,5 C5.2 ; C16.1 C7.2 104.63,15.38 v2(103.45,15.38) ; v1(14.96,11.16) 15.35,11.55 v1(15.35,12.41) ; v1(84.69,12.51) 84.68,12.5 C23.1 ; Y2.4 105.2,4.66 106.3,3.56 Y2.2 106.42,2.23 C21.2 105.66,1.46 105,1.46 104.83,1.63 C6.2 C2.1 102.18,1.29 v1(101.36,1.29) ; v1(101.36,1.29) 97.31,1.29 96.79,1.81 C10.1 ; v1(14.9,13.87) 14.62,14.16 13.97,14.16
  Top Layer w0.5: C15.2 v1(79.93,5.97) 79.52,5.97 R3.1 78.49,7 78.49,8.43
  Bottom Layer w0.2: 92.64,13.8 92.64,8.84 92.29,8.49 92.27,8.49 92.25,8.51 v1(91.22,8.51) 90.31,7.6 90.28,7.6 90.28,6.24 v1(90.35,6.17) ; v1(84.69,12.51) 84.76,12.44 v1(84.76,7.19) ; v1(97.63,13.76) 98.2,13.76 99.82,15.38 v2(103.45,15.38) ; v1(92.59,13.85) 92.66,13.78
  vias: v1(5.42,12.79) v1(5.49,6.53) v1(9.97,14.88) v1(14.17,4.93) v1(14.6,9.02) v1(14.97,5.58) v1(15.46,13.25) v1(15.97,14.62) v1(16.91,15.64) v1(17.55,12.87) v1(17.59,11.37) v1(17.87,13.94) v1(18.7,14.73) v1(19.56,18.33) v1(19.53,15.58) v1(20.66,19.6) v1(21.52,20.41) v1(23.48,18.92) v1(25.04,18.99) v1(25.7,21.13) v1(27.02,21.12) v1(27.38,19.08) v1(30.13,19.04) v1(31.55,21.04) v1(32.76,18.96) v1(34.55,21.04) v1(37.23,21.07) v1(37.7,19.07) v1(39.12,21.19) v1(41.52,21.09) v1(41.54,19.07) v1(44.2,21.13) v1(44.77,19.01) v1(47.4,21.11) v1(48.68,18.95) v1(50.36,21.13) v1(54.04,18.91) v1(55.27,21.08) v1(59.21,21.23) v1(59.35,18.96) v1(61.32,21.13) v1(63.29,19.02) v1(63.73,21.18) v1(65.89,21.15) v1(67.23,18.93) v1(68.25,21.21) v1(70.27,21.25) v1(71.07,18.97) v1(71.93,21.21) v1(73.31,21.16) v1(74.94,18.94) v1(75.36,21.18) v1(77.44,18.96) v1(79.47,18.92) v1(81.4,18.92) v1(82.52,21.22) v1(83.66,21.24) v1(84.84,18.92) v1(101.07,21.33) v1(101.45,18.76) v1(110.41,23.88) v1(115.98,20.83) v1(148.29,7.48) v1(148.31,6.51) v1(148.34,5.55) v1(149.21,7.48) v1(149.23,6.51) v1(149.26,5.55) v1(150.02,7.48) v1(150.04,6.51) v1(150.07,5.55) v1(177.61,13.35) v1(178,2.47) v1(273.98,13.67) v1(283.2,1.97)
VBAT: length 34.7
  Top Layer w0.2: v1(96.62,13.26) 97.25,12.62 97.25,11.73 U2.Y2
  Top Layer w0.5: v1(150.02,12.9) 150.02,12.11 149.08,11.18 v1(149.08,12.84) ; v1(147.69,9.4) 148.79,10.5 v1(148.79,9.32) ; TP5.1 148.32,10.41 v1(147.24,10.41) ; TP5.1 149.86,11.15 ; TP5.1 149.05,11.9 v1(148.1,12.84) ; v1(147.24,11.46) 148.73,11.46 147.73,12.46 v1(147.3,12.46) ; 149.86,11.15 v1(150.76,12.05) ; 149.86,11.15 v1(150.8,11.15) ; v1(96.62,13.26) 96.62,13.48 96.34,13.76 96.34,13.8 C13.2 ; R2.1 81.54,8.92 C14.1 81.52,9.68 ; 81.52,9.68 78.81,9.68 78.49,10 U1.2 ; 81.52,9.68 81.52,10.19 R8.1 ; v1(150.87,10.2) 150,10.2 149.78,10.42 v1(149.78,9.4)
  Top Layer w0.7: U1.2 78.49,16.1 v1(78.48,16.11)
VBUS: length 8.4
  Top Layer w0.2: C1.2 v1(95.16,12.01) 95.72,12.01 U2.AD2 ; U3.4 13.17,13.13 v1(12.71,12.66)
  Top Layer w0.5: v1(9.67,4.17) 9.13,4.71 8.05,4.71 ; 10.1,9.6 v1(10.09,9.61) 8.05,9.61 ; v1(85.85,7.94) 85.83,7.92 D61.2
VDD_NRF: length 62.5
  Top Layer w0.2: v1(104.7,6.87) 104.7,6.85 104.41,6.56 U2.A22 ; 94.17,14.94 C19.2 ; 98.22,14.21 98.22,13.46 97.67,12.91 U2.W1 ; U2.B1 102.18,12.05 103.12,12.05 104.16,13.08 105.43,13.08 106.81,14.46 ; U2.AD14 v1(94.09,8.56) ; 106.81,15.95 v1(106.59,16.17) ; U2.AD23 93.88,6.06 93.72,6.22 v1(93.72,6.47) 93.68,6.51 ; 92.85,6.46 C18.2
  Top Layer w0.5: v1(94.09,8.56) 94.04,8.61 C20.2 ; C18.2 93.68,6.51 ; v1(104.7,6.87) 104.84,7.01 C17.2 ; v1(110.27,11.61) 110.27,13.28 109.24,14.3 106.66,14.3 106.62,14.33 C16.2 ; 98.22,14.21 98.22,14.85 97.66,15.41 L3.1 97.21,15.83 v1(96.8,16.24) 94.41,16.24 v1(93.11,14.94) 94.17,14.94 ; 106.81,14.46 106.81,15.95
  Bottom Layer w0.2: 104.78,16.17 104.71,16.24 ; v1(106.59,16.17) 106.52,16.24
  Bottom Layer w0.5: v1(96.8,16.24) 106.52,16.24 ; v1(93.72,6.47) 93.72,8.19 v1(94.09,8.56) 93.45,9.2 93.45,14.6 v1(93.11,14.94) ; v1(110.27,11.61) 110.27,9.18 107.95,6.87 v1(104.7,6.87)
VSS_PA: length 2.3
  Top Layer w0.127: 100.86,3.81 100.86,6 U2.F23
(no net): length 0.4
  Top Layer w0.127: 100.92,6.06 100.92,6.45
/ANT: length 28
  Top Layer w0.25: 95.04,1.72 91.41,1.72 91.41,4.67 89.35,4.67 89.35,1.72 87.38,1.72 87.38,4.7 85.42,4.7 85.42,1.72 83.53,1.72 83.53,4.91
  Top Layer w0.62: R1.2 95.02,1.84
/CC1: length 2.2
  Top Layer w0.2: R6.1 10.08,8.41 8.05,8.41
/CC2: length 3.8
  Top Layer w0.2: 11.35,4.2 11.31,4.2 10.1,5.41 8.05,5.41
/COL_0: length 277.6
  Top Layer w0.2: v1(122.01,16) 122.42,16.41 273.97,16.41 K60.1 281.3,33.27 K41.1 276.54,47.55 K28.1 278.92,64.22 K27.1 283.68,85.66 K0.1 ; v1(109.96,18.1) 99.36,18.1 98.81,17.55 98.81,13.48 98.17,12.84 U2.U1
  Bottom Layer w0.2: v1(122.01,16) 121.66,16.35 111.71,16.35 v1(109.96,18.1)
/COL_1: length 272
  Top Layer w0.2: v1(110.64,6.45) 110.07,5.88 110.07,5.3 111.1,4.27 114,4.27 120.09,10.36 120.09,16.13 120.67,16.71 250.46,16.71 K59.1 257.45,23.77 257.45,33.2 247.86,42.79 K51.1 240.82,52.32 K39.1 255.1,66.6 K26.1 264.63,90.42 K1.1 ; U2.A8 103.31,10.06 103.57,9.81 110.45,9.81 v1(111.55,10.9)
  Bottom Layer w0.2: v1(111.55,10.9) 111.02,10.37 111.02,6.79 110.67,6.45 v1(110.64,6.45)
/COL_2: length 240.7
  Top Layer w0.2: K12.1 236.06,90.42 K25.1 231.29,76.13 231.29,61.84 221.77,52.32 K50.1 233.67,30.88 K58.1 226.94,17.01 120.54,17.01 119.78,16.25 119.78,10.48 113.87,4.57 111.22,4.57 110.77,5.03 v1(110.77,5.54) ; v1(111.94,10.17) 111.13,9.36 102.88,9.36 U2.A10
  Bottom Layer w0.2: v1(111.94,10.17) 111.31,9.54 111.31,6.09 v1(110.77,5.54)
/COL_3: length 191.2
  Top Layer w0.2: v1(112.21,9.41) 111.86,9.06 U2.A12 ; v1(111.61,5.5) 112.09,5.02 113.9,5.02 119.48,10.61 119.48,16.47 120.32,17.31 177.24,17.31 K49.1 202.72,52.32 K37.1 212.24,76.13 K24.1 217,90.42 K11.1
  Bottom Layer w0.2: v1(111.61,5.5) 111.61,8.81 v1(112.21,9.41)
/COL_4: length 175.4
  Top Layer w0.2: v1(113.14,9.58) 112.12,8.56 U2.A14 ; K10.1 197.95,90.42 K23.1 193.19,76.13 193.19,61.84 183.67,52.32 K48.1 183.92,42.54 183.92,38.67 162.91,17.67 120.1,17.67 119.19,16.75 119.19,10.73 114.11,5.66 v1(112.52,5.66)
  Bottom Layer w0.2: v1(113.14,9.58) 111.95,8.39 111.95,6.69 112.52,6.12 v1(112.52,5.66)
/COL_5: length 161.4
  Top Layer w0.2: K9.1 178.91,90.42 K22.1 178.91,76.75 174.2,72.05 174.2,61.9 K35.1 174.14,59.16 164.62,49.63 K47.1 164.62,26.12 K56.1 162.27,23.7 162.27,18.97 161.57,18.27 119.7,18.27 118.63,17.2 118.63,10.96 114.53,6.85 v1(112.82,6.85) ; v1(112.74,8.16) 103.3,8.16 103.18,8.04 103.16,8.06 U2.A16
  Bottom Layer w0.2: v1(112.82,6.85) 112.82,8.08 v1(112.74,8.16)
/COL_6: length 138.2
  Top Layer w0.2: K8.1 169.38,98.95 160.06,89.64 160.06,81.1 K21.1 159.85,79.83 155.44,75.42 155.44,62.19 K34.1 155.09,60.86 146.16,51.93 146.16,43.38 K46.1 139.12,36.34 120.54,36.34 118.34,34.13 118.34,11.08 114.86,7.61 104.18,7.61 103.63,7.06 U2.A20
/COL_7: length 131.3
  Top Layer w0.2: v1(113.79,8.34) 113.84,8.29 114.88,8.29 118,11.41 118,34.27 K45.1 126.52,47.47 136.04,57 136.04,61.84 K33.1 136.04,73.16 140.82,77.94 140.82,80.87 K20.1 140.81,87.64 150.43,97.27 150.43,99.94 K7.1 ; v1(99.29,4.17) 99.41,4.17 100.17,4.93 U2.J24
  Bottom Layer w0.2: 113.79,10.86 112.33,12.32 106.04,12.32 100.14,6.42 100.14,4.82 99.49,4.17 v1(99.29,4.17) ; 113.79,10.86 113.79,8.34
/COL_8: length 131.9
  Top Layer w0.2: v1(114.29,9.32) 115.25,9.32 117.69,11.77 117.69,16.17 112.79,21.08 107.91,21.08 107.47,21.52 K44.1 107.47,49.48 116.66,58.67 116.66,61.5 K32.1 116.99,72.83 121.66,77.49 121.66,80.79 K19.1 121.75,87.32 131.36,96.93 131.36,99.86 131.28,99.94 ; v1(99.39,4.86) 99.3,4.95 99.3,5.19 U2.L24
  Bottom Layer w0.2: v1(114.29,9.32) 114.09,9.52 114.09,11.18 112.65,12.62 105.59,12.62 99.41,6.45 99.41,4.88 v1(99.39,4.86)
/COL_9: length 149.7
  Top Layer w0.2: U2.R24 98.67,5.49 98.38,5.19 v1(98.38,4.71) ; v1(114.6,10.48) 115.71,10.48 117.39,12.17 117.39,16.05 112.66,20.78 107.78,20.78 106.26,22.3 92.37,22.3 90.93,23.74 K57.1 94.14,27.09 94.14,36.49 88.42,42.22 K43.1 95.24,49.62 95.24,57.45 97.94,60.15 K31.1 97.94,72.61 102.7,77.37 K18.1 102.7,87.58 112.04,96.92 112.04,99.76 112.23,99.94
  Bottom Layer w0.2: v1(114.6,10.48) 114.4,10.68 114.4,11.31 112.78,12.92 105.27,12.92 98.67,6.33 98.67,5.47 98.38,5.17 v1(98.38,4.71)
/COL_10: length 174.3
  Top Layer w0.2: v1(114.9,11.62) 116.42,11.62 117.09,12.29 117.09,15.93 112.54,20.48 97.29,20.48 96.4,21.37 93.32,21.37 92.43,20.48 68,20.48 66.99,21.5 K55.1 69.37,26.12 K42.1 69.37,53.93 72.03,56.6 76.24,56.6 78.89,59.25 K30.1 81.36,64.31 81.36,76.25 83.66,78.54 K17.1 83.66,86.64 93.27,96.25 93.27,99.86 K4.1 ; v1(97.68,4.76) 97.68,4.93 98.17,5.42 U2.U24
  Bottom Layer w0.2: v1(97.68,4.76) 97.68,4.93 98.16,5.41 98.16,6.25 105.15,13.23 113.74,13.23 114.69,12.28 114.69,11.82 v1(114.9,11.62)
/COL_11: length 187.2
  Top Layer w0.2: U2.W24 96.93,4.82 v1(96.93,4.62) ; v1(116.39,13.09) 116.41,13.11 116.41,16.19 112.41,20.18 97.17,20.18 96.28,21.07 93.45,21.07 92.56,20.18 50.34,20.18 49.23,21.29 49.23,51.22 K29.1 59.84,62.81 63.74,66.71 63.74,80.03 K16.1 67.45,83.74 67.45,92.49 74.13,99.17 K3.1
  Bottom Layer w0.2: v1(96.93,4.62) 96.97,4.66 96.97,4.95 97.56,5.54 97.56,5.66 97.72,5.82 97.72,6.23 105.02,13.53 115.9,13.53 116.34,13.09 v1(116.39,13.09)
/COL_12: length 188.2
  Top Layer w0.2: K2.1 45.55,90.42 K15.1 45.55,78.51 K40.1 33.65,57.08 K52.1 43.17,33.27 43.17,23.74 47.03,19.88 92.68,19.88 93.57,20.77 96.15,20.77 97.05,19.87 111.78,19.87 115.78,15.87 v1(115.78,15) ; v1(99.71,12.79) 99.67,12.75 U2.L1
  Bottom Layer w0.2: v1(99.71,12.79) 102.53,12.79 104.49,14.74 115.53,14.74 v1(115.78,15)
/COL_13: length 204.9
  Top Layer w0.2: U2.N1 99.17,12.67 v1(98.98,12.86) ; K13.1 26.5,85.65 K14.1 10.12,69.26 10.12,43.56 19.36,34.31 K53.1 23.52,19.58 92.8,19.58 93.69,20.47 96.02,20.47 96.91,19.57 111.14,19.57 v1(115.12,15.59)
  Bottom Layer w0.2: v1(98.98,12.86) 98.98,12.96 99.44,13.42 102.74,13.42 104.36,15.04 104.37,15.04 104.89,15.57 115.1,15.57 v1(115.12,15.59)
/ROW_0: length 394.8
  Top Layer w0.2: v1(198.76,111.56) 198.75,111.55 D10.1 ; D4.1 84.42,111.54 v1(84.44,111.56) ; D6.1 122.53,111.55 v1(122.51,111.56) ; U2.AD8 96.02,9.91 92.46,9.91 92.17,10.2 91.7,10.2 91.36,9.87 91.06,9.87 v1(90.98,9.79) ; v1(179.64,111.56) 179.66,111.55 D9.1 ; D8.1 160.61,111.55 v1(160.6,111.56) ; v1(103.47,111.56) 103.48,111.55 D5.1 ; D0.1 275.02,111.51 v1(274.97,111.56) ; D3.1 65.38,111.54 v1(65.35,111.56) ; D1.1 17.76,110.41 v1(17.76,111.56) ; v1(217.78,111.56) 217.81,111.53 D11.1 ; D12.1 v1(236.84,111.56) ; D2.1 v1(46.33,111.56) ; D13.1 255.81,111.53 v1(255.78,111.56) ; D7.1 141.6,111.53 v1(141.57,111.56)
  Bottom Layer w0.2: v1(17.76,111.56) v1(46.33,111.56) 57.49,111.56 ; 57.49,111.56 57.49,97.12 66.34,88.26 66.34,77.91 90.13,54.12 90.13,25.04 90.98,24.19 v1(90.98,9.79) ; 57.49,111.56 v1(65.35,111.56) v1(84.44,111.56) v1(103.47,111.56) v1(122.51,111.56) v1(141.57,111.56) v1(160.6,111.56) v1(179.64,111.56) v1(198.76,111.56) v1(217.78,111.56) v1(236.84,111.56) v1(255.78,111.56) v1(274.97,111.56)
/ROW_1: length 375.6
  Top Layer w0.2: v1(59.24,92.51) v1(64.08,92.51) ; v1(90.14,9.21) 90.16,9.2 94.78,9.2 94.92,9.06 U2.AD12 ; D20.1 132.03,92.5 v1(132.04,92.51) ; D23.1 189.2,92.5 v1(189.19,92.51) ; D19.1 v1(112.99,92.51) ; D22.1 170.16,92.48 v1(170.19,92.51) ; D14.1 v1(12.94,92.51) ; D17.1 v1(74.88,92.51) ; D24.1 208.25,92.48 v1(208.28,92.51) ; D26.1 246.35,92.49 v1(246.37,92.51) ; D18.1 v1(93.95,92.51) ; D15.1 v1(36.77,92.51) ; v1(270.16,92.52) D27.1 ; D16.1 55.85,92.5 v1(55.85,92.51) ; D21.1 v1(151.11,92.51) ; D25.1 227.29,92.5 v1(227.31,92.51)
  Bottom Layer w0.2: v1(12.94,92.51) v1(36.77,92.51) v1(55.85,92.51) v1(59.24,92.51) 64.73,87.01 64.73,78.53 89.66,53.6 89.66,24.5 90.13,24.04 90.13,9.23 v1(90.14,9.21) ; v1(270.16,92.52) 270.15,92.51 v1(246.37,92.51) v1(227.31,92.51) v1(208.28,92.51) v1(189.19,92.51) v1(170.19,92.51) v1(151.11,92.51) v1(132.04,92.51) v1(112.99,92.51) v1(93.95,92.51) v1(74.88,92.51) v1(64.08,92.51)
/ROW_2: length 355.2
  Top Layer w0.2: v1(127.27,73.52) 127.27,72.4 127.26,72.39 ; v1(65.41,73.51) 65.43,73.48 v1(73.49,73.48) ; U2.AD16 94.98,8.06 94.77,7.84 89.67,7.84 89.31,8.2 89.31,9.49 v1(89.32,9.5) ; 184.44,72.46 184.44,73.5 v1(184.44,73.51) ; v1(267.74,73.5) 267.77,73.47 D40.1 ; 108.24,72.39 108.24,73.5 v1(108.23,73.51) ; 222.4,72.45 222.41,72.46 v1(222.41,73.51) ; 89.16,72.4 89.16,73.46 v1(89.13,73.48) ; v1(20.01,73.55) 20.02,73.54 20.02,72.42 ; 51.05,72.44 51.05,73.5 v1(51.05,73.51) ; 203.47,72.41 203.49,72.42 v1(203.49,73.51) ; v1(146.35,73.52) 146.35,73.52 146.35,72.39 ; v1(165.34,73.52) 165.36,73.5 165.36,72.34 ; 73.49,73.38 73.49,72.43 73.44,72.38 ; 241.53,72.43 241.53,73.51
  Bottom Layer w0.2: v1(20.01,73.55) 20.05,73.51 v1(51.05,73.51) v1(65.41,73.51) 65.41,59.54 67.44,57.5 84.91,57.5 89.33,53.08 89.34,24.21 89.82,23.72 89.82,14.69 89.38,14.24 89.38,9.55 v1(89.32,9.5) ; v1(267.74,73.5) 263.03,73.5 263.02,73.51 v1(241.53,73.51) v1(222.41,73.51) v1(203.49,73.51) v1(184.44,73.51) 174.91,73.51 174.91,73.52 v1(165.34,73.52) v1(146.35,73.52) v1(127.27,73.52) 108.24,73.52 v1(108.23,73.51) 98.71,73.51 98.68,73.48 v1(89.13,73.48) v1(73.49,73.48)
/ROW_3: length 316.4
  Top Layer w0.2: v1(194.04,54.57) 194.04,53.26 D49.1 ; v1(213.01,54.57) 213.01,54.57 D50.1 ; v1(263,54.61) 263.03,54.57 D52.1 ; 79.67,54.57 79.69,54.55 D43.1 ; 79.67,54.57 v1(72.85,54.57) ; 79.67,54.57 v1(90.99,54.57) ; v1(60.57,54.57) 60.57,53.25 D42.1 ; v1(88.84,10.27) 88.77,10.19 88.77,7.88 89.17,7.47 95.22,7.47 95.3,7.56 U2.AD18 ; v1(155.8,54.57) 155.81,54.56 D47.1 ; D45.1 117.72,53.24 v1(117.72,54.57) ; v1(24.87,54.6) 24.84,54.57 D41.1 ; v1(136.76,54.57) 136.77,54.55 D46.1 ; v1(98.71,54.57) 98.73,54.55 D44.1 ; D51.1 232.01,54.57 ; v1(174.82,54.57) 174.84,54.55 D48.1
  Bottom Layer w0.2: v1(88.84,10.27) 88.84,14.62 89.43,15.21 89.43,17.68 80.09,27.02 80.09,31.59 80.81,32.31 80.81,42.51 72.85,50.47 v1(72.85,54.57) v1(60.57,54.57) 24.9,54.57 v1(24.87,54.6) ; v1(90.99,54.57) v1(98.71,54.57) v1(117.72,54.57) v1(136.76,54.57) v1(155.8,54.57) v1(174.82,54.57) v1(194.04,54.57) v1(213.01,54.57) v1(232.01,54.57) 262.96,54.57 v1(263,54.61)
/ROW_4: length 313.4
  Top Layer w0.2: D58.1 224.92,35.39 v1(224.95,35.42) ; U2.AD20 95.33,7.06 95.22,7.17 88.67,7.17 88.3,7.54 v1(88.3,10.92) ; 85.63,35.42 85.66,35.39 D57.1 ; 85.63,35.42 v1(92.6,35.42) ; 85.63,35.42 85.62,35.43 v1(77.82,35.43) ; D53.1 v1(10.62,35.42) ; v1(34.43,35.42) 34.44,35.41 D54.1 ; D56.1 153.48,35.41 v1(153.47,35.42) ; v1(248.74,35.42) 248.73,35.41 D59.1 ; v1(58.24,35.42) 58.23,35.41 D55.1 ; v1(272.53,35.43) 272.53,34.22 D60.1
  Bottom Layer w0.2: v1(92.6,35.42) v1(153.47,35.42) v1(224.95,35.42) v1(248.74,35.42) 272.52,35.42 v1(272.53,35.43) ; 76.39,35.42 76.39,29.81 89.08,17.12 89.08,15.55 88.3,14.77 v1(88.3,10.92) ; 76.39,35.42 v1(58.24,35.42) v1(34.43,35.42) v1(10.62,35.42) ; 76.39,35.42 76.41,35.43 v1(77.82,35.43)
BAT_VOLT: length 31.7
  Top Layer w0.2: U2.J1 100.17,12.35 100.38,12.56 100.38,12.57 100.52,12.71 100.52,12.98 100.16,13.35 99.57,13.35 99.29,13.63 99.29,16.58 v1(100.15,17.44)
  Top Layer w0.5: 84.66,9.82 85.55,9.82 85.91,10.17 85.91,16.5 86.41,17 96.48,17 v1(96.82,17.34) ; 84.66,9.82 84.66,10.38 ; 84.66,9.82 R10.1 ; 83.39,10.37 84.65,10.37 84.66,10.38 ; 84.66,10.38 C23.2
  Bottom Layer w0.5: v1(96.82,17.34) 96.92,17.44 v1(100.15,17.44)
BLUE_LED: length 138.6
  Top Layer w0.2: D63.2 2.25,14.21 v1(1.98,14.48) ; v1(91.96,9.7) 92.1,9.56 U2.AD10 ; v1(90.84,36.2) v1(77.77,36.2)
  Bottom Layer w0.2: v1(90.84,36.2) 90.85,36.2 91.96,35.09 v1(91.96,9.7) ; v1(1.98,14.48) 1.94,14.53 1.94,28.22 9.92,36.2 v1(77.77,36.2)
NET-(C11-PAD2): length 3
  Top Layer w0.62: R1.1 96.13,3.21 L4.1 98.04,2.22 C11.2
NET-(D0-A): length 12.1
  Top Layer w0.2: K0.2 270.21,104.18 D0.2
NET-(D1-A): length 12
  Top Layer w0.2: D13.2 251.16,104.34 K1.2
NET-(D2-A): length 12.1
  Top Layer w0.2: D2.2 41.61,104.28 K2.2
NET-(D3-A): length 12
  Top Layer w0.2: D3.2 60.66,104.25 K3.2
NET-(D4-A): length 12.1
  Top Layer w0.2: K4.2 79.7,104.28 D4.2
NET-(D5-A): length 12.1
  Top Layer w0.2: K5.2 98.75,104.26 D5.2
NET-(D6-A): length 12
  Top Layer w0.2: K6.2 117.81,104.26 D6.2
NET-(D7-A): length 12.1
  Top Layer w0.2: D7.2 136.85,104.23 136.85,98.89
NET-(D8-A): length 12.1
  Top Layer w0.2: K8.2 155.91,104.31 D8.2
NET-(D9-A): length 12.1
  Top Layer w0.2: D9.2 174.95,104.32 K9.2
NET-(D10-A): length 12
  Top Layer w0.2: D10.2 194,104.22 K10.2
NET-(D11-A): length 12.1
  Top Layer w0.2: D11.2 213.06,104.26 K11.2
NET-(D12-A): length 12.1
  Top Layer w0.2: K12.2 232.1,104.27 D12.2
NET-(D13-A): length 12.1
  Top Layer w0.2: D1.2 13.03,104.28 K13.2
NET-(D14-A): length 12.1
  Top Layer w0.2: D14.2 8.27,85.29 K14.2
NET-(D15-A): length 12.1
  Top Layer w0.2: D15.2 32.08,85.28 K15.2
NET-(D16-A): length 12.1
  Top Layer w0.2: D16.2 51.13,85.24 51.13,79.84
NET-(D17-A): length 12.1
  Top Layer w0.2: K17.2 70.18,85.25 D17.2
NET-(D18-A): length 12.1
  Top Layer w0.2: D18.2 89.23,85.25 K18.2
NET-(D19-A): length 12.1
  Top Layer w0.2: 108.28,79.84 108.28,85.23 D19.2
NET-(D20-A): length 12.1
  Top Layer w0.2: K20.2 127.33,85.24 D20.2
NET-(D21-A): length 12.1
  Top Layer w0.2: D21.2 146.38,85.22 K21.2
NET-(D22-A): length 12.1
  Top Layer w0.2: K22.2 165.43,85.23 D22.2
NET-(D23-A): length 12.1
  Top Layer w0.127: K23.2 184.48,85.22 D23.2
NET-(D24-A): length 12.1
  Top Layer w0.2: K24.2 203.53,85.24 D24.2
NET-(D25-A): length 12.1
  Top Layer w0.2: K25.2 222.58,85.23 D25.2
NET-(D26-A): length 12.1
  Top Layer w0.2: D26.2 241.63,85.23 K26.2
NET-(D27-A): length 12.1
  Top Layer w0.127: D27.2 265.44,85.25 K27.2
NET-(D28-A): length 12.1
  Top Layer w0.2: K28.2 263.06,66.19 D40.2
NET-(D29-A): length 12.2
  Top Layer w0.2: K29.2 46.37,66.36 51.05,71.04
NET-(D30-A): length 16.4
  Top Layer w0.2: K30.2 65.42,67.88 68.52,70.98 73.44,70.98
NET-(D31-A): length 12.2
  Top Layer w0.2: 89.16,71 84.47,66.31 K31.2
NET-(D32-A): length 12.2
  Top Layer w0.2: 108.24,70.99 103.52,66.26 K32.2
NET-(D33-A): length 12.1
  Top Layer w0.2: D33.2 122.57,66.2 K33.2
NET-(D34-A): length 12.1
  Top Layer w0.2: D34.2 141.62,66.16 K34.2
NET-(D35-A): length 12.1
  Top Layer w0.2: K35.2 160.67,66.2 D35.2
NET-(D36-A): length 12.1
  Top Layer w0.2: K36.2 179.72,66.14 D36.2
NET-(D37-A): length 12.1
  Top Layer w0.2: D37.2 198.77,66.19 K37.2
NET-(D38-A): length 12
  Top Layer w0.2: D38.2 217.82,66.31 K38.2
NET-(D39-A): length 12
  Top Layer w0.2: K39.2 236.87,66.23 D39.2
NET-(D40-A): length 12.1
  Top Layer w0.2: K40.2 15.41,66.42 20.02,71.02
NET-(D41-A): length 12.1
  Top Layer w0.2: K41.2 258.3,47.1 D52.2
NET-(D42-A): length 12
  Top Layer w0.2: K42.2 55.89,47.17 D42.2
NET-(D43-A): length 12.1
  Top Layer w0.2: D43.2 74.94,47.08 K43.2
NET-(D44-A): length 12.1
  Top Layer w0.2: K44.2 93.99,47.09 D44.2
NET-(D45-A): length 12
  Top Layer w0.2: K45.2 113.04,47.16 D45.2
NET-(D46-A): length 12
  Top Layer w0.2: D46.2 132.09,47.15 K46.2
NET-(D47-A): length 12
  Top Layer w0.2: K47.2 151.14,47.16 D47.2
NET-(D48-A): length 12.1
  Top Layer w0.2: K48.2 170.19,47.19 174.87,51.87
NET-(D49-A): length 12.1
  Top Layer w0.2: D49.2 189.24,47.06 K49.2
NET-(D50-A): length 12
  Top Layer w0.2: D50.2 208.29,47.11 K50.2
NET-(D51-A): length 12
  Top Layer w0.2: D51.2 227.34,47.16 K51.2
NET-(D52-A): length 12
  Top Layer w0.2: K52.2 20.17,47.17 D41.2
NET-(D53-A): length 12.1
  Top Layer w0.2: K53.2 5.89,28.07 D53.2
NET-(D54-A): length 12
  Top Layer w0.2: D54.2 29.7,28.03 K54.2
NET-(D55-A): length 12.1
  Top Layer w0.2: D55.2 53.51,28.08 K55.2
NET-(D56-A): length 12
  Top Layer w0.2: D56.2 148.76,28.05 K56.2
NET-(D57-A): length 15.9
  Top Layer w0.2: D57.2 85.58,32.7 81.56,32.7 77.32,28.46 77.32,22.69
NET-(D58-A): length 12
  Top Layer w0.2: K58.2 220.2,28.05 D58.2
NET-(D59-A): length 12
  Top Layer w0.2: K59.2 244.01,28.06 D59.2
NET-(D60-A): length 12.1
  Top Layer w0.2: D60.2 267.82,28.08 K60.2
NET-(D61-K): length 5.5
  Top Layer w0.5: D61.1 82.61,6.4 82.08,6.93 C15.1 80.29,6.93 79.44,7.78 79.44,8.43
NET-(D62-A): length 92.9
  Top Layer w0.2: R2.2 83.78,7.9 v1(83.79,7.89) ; v1(22.48,17.37) 22.23,17.62 14.83,17.62 13.47,18.98 4.88,18.98 3.24,17.34 D62.2
  Bottom Layer w0.2: v1(22.48,17.37) 22.48,13.59 22.86,13.21 82.66,13.21 84.09,11.78 84.09,8.19 v1(83.79,7.89)
NET-(D62-K): length 79
  Top Layer w0.2: U1.3 77.54,14.62 75.49,16.67 14.1,16.67 12.47,18.3 6.81,18.3 4.81,16.3 D62.1
NET-(D63-K): length 5.7
  Top Layer w0.2: D63.1 5,14 5.74,14 6.85,15.12 6.85,16.37 7.58,17.1 R5.2
NET-(L1-PAD2): length 1.5
  Top Layer w0.5: L1.2 108.21,11.19 L2.1 108.36,12.51
NET-(P1-SHIELD): length 21.7
  Top Layer w0.2: C24.1 8.28,15.51 8.28,14.24 R11.2 8.26,12.61 7.13,11.48
  Bottom Layer w0.2: 7.13,11.48 2.96,11.48 2.96,2.84 7.13,2.84
NET-(R8-PAD2): length 1.7
  Top Layer w0.5: R9.1 83.38,12.03 R8.2
NET-(U1-ISET): length 2.1
  Top Layer w0.5: R3.2 77.41,8.29 77.54,8.43
NET-(U1-TS): length 2.5
  Top Layer w0.5: R4.2 79.44,13.08 U1.1
NET-(U2-ANT): length 4
  Top Layer w0.127: U2.H23 100.55,5.94 100.55,3.97 C12.2
  Top Layer w0.62: L4.2 99.79,3.21 C12.2
NET-(U2-DCC): length 5
  Top Layer w0.2: U2.B3 103.08,11.31 104.27,12.49 104.29,12.49 104.31,12.51 L2.2
NET-(U2-DCCH): length 4.7
  Top Layer w0.2: L3.2 95.28,15.06 95.28,14.66 95.29,14.65 95.29,13.62 95.3,13.62 96.92,12 U2.AB2
NET-(U2-DEC1): length 4
  Top Layer w0.2: C7.1 104.72,14.24 103.04,12.56 102.17,12.56 U2.C1
NET-(U2-DEC3): length 4.3
  Top Layer w0.2: C6.1 103.52,3.71 101.42,5.81 U2.D23
NET-(U2-DEC4): length 23.1
  Top Layer w0.2: U2.E24 102.52,4.21 C2.2 v1(101.91,2.59) ; U2.B5 103.12,10.81 104,11.69 C3.2 105.21,11.69 105.69,11.21 v1(106.25,11.21) 107.54,11.21
  Bottom Layer w0.2: v1(106.25,11.21) 106.25,10.83 103.88,8.46 103.88,1.91 103.56,1.59 102.46,1.59 101.91,2.15 v1(101.91,2.59)
NET-(U2-DEC5): length 6.4
  Top Layer w0.2: C5.1 94.5,4.11 98.52,4.11 98.88,4.46 98.88,5.26 U2.N24
NET-(U2-DECUSB): length 3.6
  Top Layer w0.2: U2.AC5 96.55,10.93 96.55,11.69 95.23,13.01 C4.1
NET-(U2-XC1): length 5.7
  Top Layer w0.2: C21.1 105.02,2.63 Y2.1 104.38,3.56 103.72,4.21 103.72,5.01 103.17,5.56 U2.B24
NET-(U2-XC2): length 4.7
  Top Layer w0.2: U2.A23 102.72,6.01 C22.1 105.64,5.44 Y2.3
NET-(U2-XL1{SLASH}P0.00): length 4.4
  Top Layer w0.2: Y1.1 102.34,14.36 C8.2 102.82,13.8 101.32,12.3 101.32,11.75 101.42,11.65 U2.D2
NET-(U2-XL2{SLASH}P0.01): length 4.7
  Top Layer w0.2: C9.2 100.34,14.48 Y1.2 100.22,14.02 101.02,13.22 101.02,11.66 U2.F2
RESET: length 93.9
  Top Layer w0.2: U2.AC13 U2.AC11 U2.AC9 v3(96.67,10.33) ; v1(29.01,15.99) 27.66,14.65 27.66,12.3 26.52,11.15 26.52,11.12 20.14,11.12 SW1.1 SW1.1 ; v1(92.78,17.83) 92.38,18.24 v1(71.66,18.24)
  Bottom Layer w0.2: v1(92.78,17.83) 94.8,15.81 94.8,13.65 96.67,11.78 v3(96.67,10.33) ; v1(29.01,15.99) 31.26,18.24 v1(71.66,18.24) 71.67,18.25
SWC: length 43.6
  Top Layer w0.2: v1(95.86,5.04) 96.66,5.04 U2.AA24
  Bottom Layer w0.2: J3.2 129.95,8.92 125.03,13.84 110.66,13.84 110.66,13.83 104.9,13.83 97.27,6.2 97.27,5.67 96.64,5.04 v1(95.86,5.04)
SWD: length 46.8
  Top Layer w0.2: v1(95.23,5.45) 95.34,5.56 U2.AC24
  Bottom Layer w0.2: J3.3 132.5,8.99 127.34,14.14 105.45,14.14 105.44,14.13 104.77,14.13 96.89,6.25 96.89,5.79 96.68,5.58 96.31,5.58 96.3,5.59 95.5,5.59 95.36,5.45 v1(95.23,5.45)
SWO: length 49.3
  Top Layer w0.2: U2.AD22 94.88,6.56 v1(94.83,6.61)
  Bottom Layer w0.2: v1(94.83,6.61) 96.83,6.61 104.65,14.43 104.9,14.43 104.91,14.44 129.97,14.44 135.03,9.38 J3.4
USB_D+: length 114.4
  Top Layer w0.158: U2.AD6 95.95,10.56 95.88,10.63 91.68,10.63 87.51,14.8 87.51,15.28 87.27,15.52 v1(87.27,15.92)
  Top Layer w0.2: 8.05,6.41 6.44,6.41 6.08,6.77 6.08,7.09 6.61,7.61 7.1,7.61 7.3,7.41 9.14,7.41 9.16,7.39 10.22,7.39 12.1,5.51 12.68,5.51 13.57,6.39 13.57,11.71 v1(13.37,11.91) 13.57,12.11 13.57,12.97 13.55,12.99 13.55,13.48 U3.5
  Bottom Layer w0.158: v1(87.27,15.92) 87.27,16.32 87.51,16.56 87.51,17.22 84.59,20.14 22.98,20.14 16.91,14.08 16.91,11.18 15.81,10.08 14.07,10.08 13.78,10.36 13.78,10.85 13.61,11.02 13.61,11.27 13.37,11.51 v1(13.37,11.91)
USB_D-: length 114.4
  Top Layer w0.158: v1(88.12,15.92) 88.12,15.52 87.88,15.28 87.88,14.95 88.91,13.92 89.07,13.92 89.23,14.08 89.39,14.08 90.31,13.16 90.31,13 90.14,12.84 90.14,12.68 91.83,10.99 95.88,10.99 95.95,11.06 U2.AD4
  Top Layer w0.2: 8.05,7.91 7.27,7.91 6.81,8.37 v1(6.71,8.37) ; U3.6 14,13.48 14,13.16 14.02,13.14 14.02,12.11 v1(14.22,11.91) 14.02,11.71 14.02,6.21 12.87,5.06 11.92,5.06 10.04,6.94 9.16,6.94 9.14,6.91 6.96,6.91 v1(6.85,7.01)
  Bottom Layer w0.158: v1(88.12,15.92) 88.12,16.32 87.88,16.56 87.88,17.37 84.74,20.5 22.83,20.5 16.55,14.23 16.55,11.33 15.66,10.44 14.33,10.44 14.22,10.55 v1(14.22,11.91)
  Bottom Layer w0.2: v1(6.85,7.01) 6.85,8.23 v1(6.71,8.37)

## Copper pours and planes (outline as drawn; the poured copper is in the pictures)
GND on Top Layer: -0.19,114.17 285.47,114.17 285.47,-1.01 -0.19,-1.01
GND on Bottom Layer: 189.11,20.75 192.34,20.75 192.34,17.52 189.11,17.52
GND on Bottom Layer: 107.08,10.82 107.09,10.31 107.05,9.17 109.39,9.37 109.95,11.03 109.72,11.43 108.73,11.54
GND on Bottom Layer: 126.87,58.59 129.98,58.59 129.98,55.47 126.87,55.47
